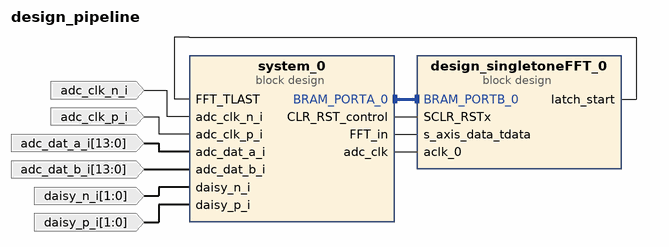
[diagram p0: block diagram of the top level]
# Vivado block design design_pipeline, xc7z010clg400-1, Vivado 2024.2
create_bd_design design_pipeline

create_bd_port -dir I -from 13 -to 0 adc_dat_a_i
create_bd_port -dir I -from 13 -to 0 adc_dat_b_i
create_bd_port -dir I -from 1 -to 0 daisy_p_i
create_bd_port -dir I -from 1 -to 0 daisy_n_i
create_bd_port -dir I -type clk adc_clk_p_i
create_bd_port -dir I -type clk adc_clk_n_i

create_bd_cell -type container -reference design_singletoneFFT design_singletoneFFT_0
set_property -dict [list \
  CONFIG.ACTIVE_SIM_BD design_singletoneFFT.bd \
  CONFIG.ACTIVE_SYNTH_BD design_singletoneFFT.bd \
  CONFIG.ENABLE_DFX 0 \
  CONFIG.LIST_SIM_BD design_singletoneFFT.bd \
  CONFIG.LIST_SYNTH_BD design_singletoneFFT.bd \
  CONFIG.LOCK_PROPAGATE 0 \
] [get_bd_cells design_singletoneFFT_0]
create_bd_cell -type container -reference system system_0
set_property -dict [list \
  CONFIG.ACTIVE_SIM_BD system.bd \
  CONFIG.ACTIVE_SYNTH_BD system.bd \
  CONFIG.ENABLE_DFX 0 \
  CONFIG.LIST_SIM_BD system.bd \
  CONFIG.LIST_SYNTH_BD system.bd \
  CONFIG.LOCK_PROPAGATE 0 \
] [get_bd_cells system_0]

# ---- connections ----

connect_bd_intf_net [get_bd_intf_pins system_0/BRAM_PORTA_0] [get_bd_intf_pins design_singletoneFFT_0/BRAM_PORTB_0]
connect_bd_net -net FFT_TLAST_1 [get_bd_pins design_singletoneFFT_0/latch_start] [get_bd_pins system_0/FFT_TLAST]
connect_bd_net -net adc_clk_n_i_0_1 [get_bd_ports adc_clk_n_i] [get_bd_pins system_0/adc_clk_n_i]
connect_bd_net -net adc_clk_p_i_0_1 [get_bd_ports adc_clk_p_i] [get_bd_pins system_0/adc_clk_p_i]
connect_bd_net [get_bd_ports adc_dat_a_i] [get_bd_pins system_0/adc_dat_a_i]
connect_bd_net [get_bd_ports adc_dat_b_i] [get_bd_pins system_0/adc_dat_b_i]
connect_bd_net -net daisy_n_i_0_1 [get_bd_ports daisy_n_i] [get_bd_pins system_0/daisy_n_i]
connect_bd_net -net daisy_p_i_0_1 [get_bd_ports daisy_p_i] [get_bd_pins system_0/daisy_p_i]
connect_bd_net [get_bd_pins system_0/CLR_RST_control] [get_bd_pins design_singletoneFFT_0/SCLR_RSTx]
connect_bd_net [get_bd_pins system_0/FFT_in] [get_bd_pins design_singletoneFFT_0/s_axis_data_tdata]
connect_bd_net [get_bd_pins system_0/adc_clk] [get_bd_pins design_singletoneFFT_0/aclk_0]

# ---- address map ----
assign_bd_address -offset 0x40000000 -range 8K -target_address_space [get_bd_addr_spaces system_0/PS7/processing_system7_0/Data] [get_bd_addr_segs system_0/axi_bram_ctrl_0/S_AXI/Mem0]
assign_bd_address -offset 0x42000000 -range 4K -target_address_space [get_bd_addr_spaces system_0/PS7/processing_system7_0/Data] [get_bd_addr_segs system_0/axi_gpio_0/S_AXI/Reg]

validate_bd_design
save_bd_design
